# EAGLE schematic Maze_Project (EAGLE 8.7.0)
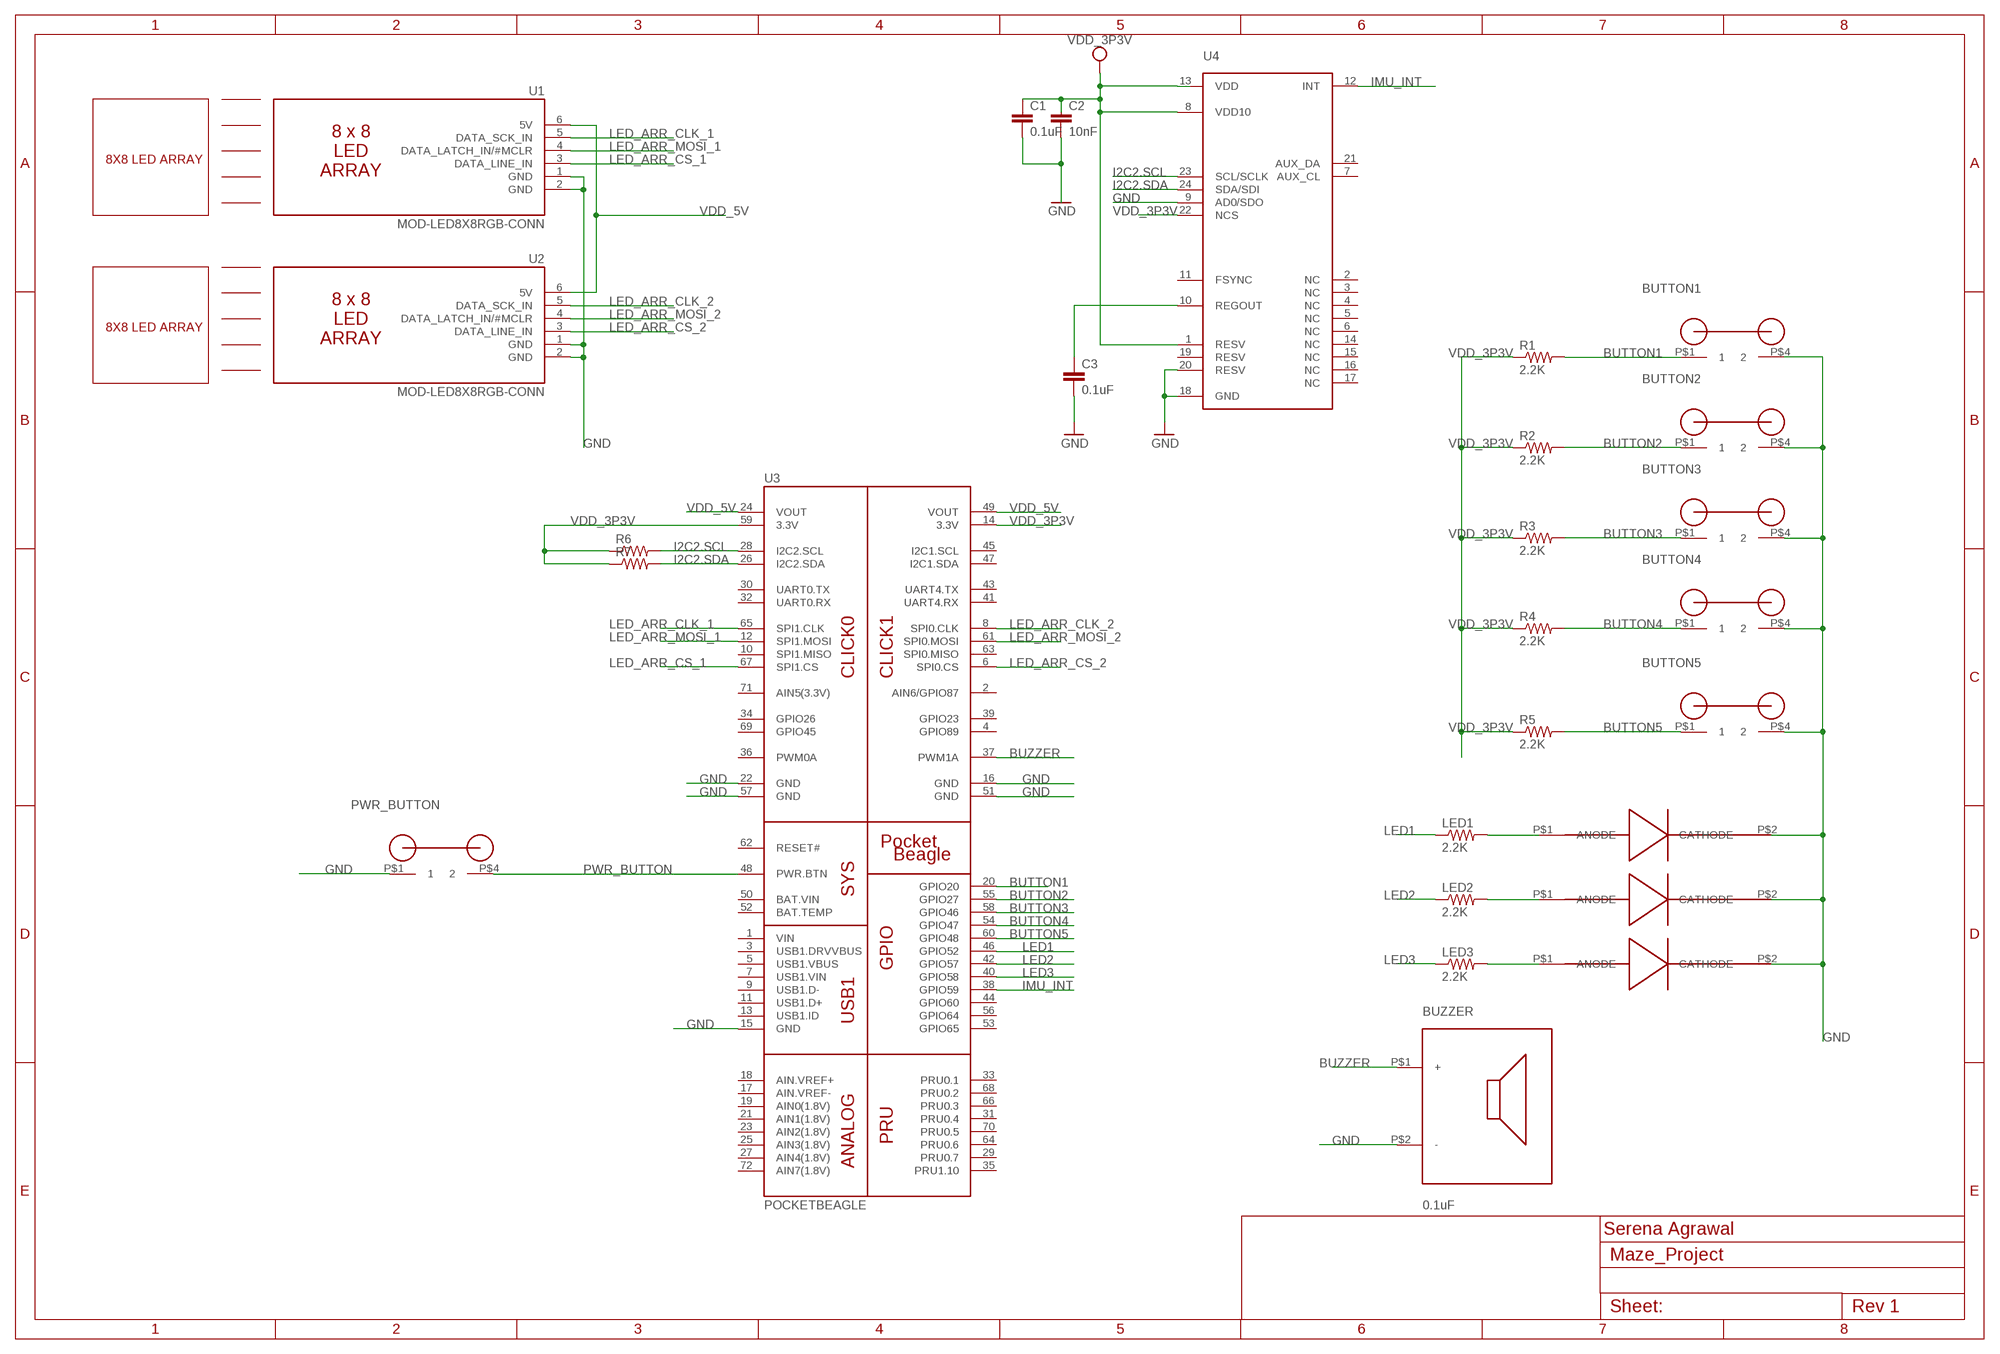
[diagram p0: schematic, sheet 1]

## Parts
BUTTON1  BUTTON  [BUTTON]
BUTTON2  BUTTON  [BUTTON]
BUTTON3  BUTTON  [BUTTON]
BUTTON4  BUTTON  [BUTTON]
BUTTON5  BUTTON  [BUTTON]
BUZZER  0.1uF  BUZZER  [BUZZER]
C1  0.1uF  C_C0402  [C0402]
C2  10nF  C_C0402  [C0402]
C3  0.1uF  C_C0402  [C0402]
LED1  2.2K  R_R0402  [R0402]
LED2  2.2K  R_R0402  [R0402]
LED3  2.2K  R_R0402  [R0402]
PWR_BUTTON  BUTTON  [BUTTON]
R1  2.2K  R_R0402  [R0402]
R2  2.2K  R_R0402  [R0402]
R3  2.2K  R_R0402  [R0402]
R4  2.2K  R_R0402  [R0402]
R5  2.2K  R_R0402  [R0402]
R6  R_R0402  [R0402]
R7  R_R0402  [R0402]
U1  MOD-LED8X8RGB-CONN  [FE06W]
U2  MOD-LED8X8RGB-CONN  [FE06W]
U3  POCKETBEAGLE  [POCKETBEAGLE]
U4  MPU-9250  [QFN-3MMX3MM]
U$7  LED  [LED]
U$8  LED  [LED]
U$9  LED  [LED]

## Nets
B: C3.2 U4.18(GND) U4.20(RESV) ; supply symbol labelled GND
BUTTON1: BUTTON1.P$1 R1.2 U3.20(GPIO20)
BUTTON2: BUTTON2.P$1 R2.2 U3.55(GPIO27)
BUTTON3: BUTTON3.P$1 R3.2 U3.58(GPIO46)
BUTTON4: BUTTON4.P$1 R4.2 U3.54(GPIO47)
BUTTON5: BUTTON5.P$1 R5.2 U3.60(GPIO48)
BUZZER: BUZZER.P$1(+) U3.37(PWM1A)
GND: BUTTON1.P$4 BUTTON2.P$4 BUTTON3.P$4 BUTTON4.P$4 BUTTON5.P$4 BUZZER.P$2(-) PWR_BUTTON.P$1 U1.1(GND) U1.2(GND) U2.1(GND) U2.2(GND) U3.15(GND) U3.16(GND) U3.22(GND) U3.51(GND) U3.57(GND) U4.9(AD0/SDO) U$7.P$2(CATHODE) U$8.P$2(CATHODE) U$9.P$2(CATHODE)
I2C2.SCL: R6.2 U3.28(I2C2.SCL) U4.23(SCL/SCLK)
I2C2.SDA: R7.2 U3.26(I2C2.SDA) U4.24(SDA/SDI)
IMU_INT: U3.38(GPIO59) U4.12(INT)
LED1: LED1.1 U3.46(GPIO52)
LED2: LED2.1 U3.42(GPIO57)
LED3: LED3.1 U3.40(GPIO58)
LED_ARR_CLK_1: U1.5(DATA_SCK_IN) U3.65(SPI1.CLK)
LED_ARR_CLK_2: U2.5(DATA_SCK_IN) U3.8(SPI0.CLK)
LED_ARR_CS_1: U1.3(DATA_LINE_IN) U3.67(SPI1.CS)
LED_ARR_CS_2: U2.3(DATA_LINE_IN) U3.6(SPI0.CS)
LED_ARR_MOSI_1: U1.4(DATA_LATCH_IN/#MCLR) U3.12(SPI1.MOSI)
LED_ARR_MOSI_2: U2.4(DATA_LATCH_IN/#MCLR) U3.61(SPI0.MOSI)
N$1: C1.2 C2.2 ; supply symbol labelled GND
N$2: C3.1 U4.10(REGOUT)
N$5: LED1.2 U$7.P$1(ANODE)
N$6: LED2.2 U$8.P$1(ANODE)
N$7: LED3.2 U$9.P$1(ANODE)
PWR_BUTTON: PWR_BUTTON.P$4 U3.48(PWR.BTN)
SYS_VDD1_3P3V: C1.1 C2.1 U4.1(RESV) U4.8(VDD10) U4.13(VDD) ; supply symbol labelled VDD_3P3V
VDD_3P3V: R1.1 R2.1 R3.1 R4.1 R5.1 R6.1 R7.1 U3.14(3.3V) U3.59(3.3V) U4.22(NCS)
VDD_5V: U1.6(5V) U2.6(5V) U3.24(VOUT) U3.49(VOUT)
Unconnected: U3.1(VIN) U3.2(AIN6/GPIO87) U3.3(USB1.DRVVBUS) U3.4(GPIO89) U3.5(USB1.VBUS) U3.7(USB1.VIN) U3.9(USB1.D-) U3.10(SPI1.MISO) U3.11(USB1.D+) U3.13(USB1.ID) U3.17(AIN.VREF-) U3.18(AIN.VREF+) U3.19(AIN0(1.8V)) U3.21(AIN1(1.8V)) U3.23(AIN2(1.8V)) U3.25(AIN3(1.8V)) U3.27(AIN4(1.8V)) U3.29(PRU0.7) U3.30(UART0.TX) U3.31(PRU0.4) U3.32(UART0.RX) U3.33(PRU0.1) U3.34(GPIO26) U3.35(PRU1.10) U3.36(PWM0A) U3.39(GPIO23) U3.41(UART4.RX) U3.43(UART4.TX) U3.44(GPIO60) U3.45(I2C1.SCL) U3.47(I2C1.SDA) U3.50(BAT.VIN) U3.52(BAT.TEMP) U3.53(GPIO65) U3.56(GPIO64) U3.62(RESET#) U3.63(SPI0.MISO) U3.64(PRU0.6) U3.66(PRU0.3) U3.68(PRU0.2) U3.69(GPIO45) U3.70(PRU0.5) U3.71(AIN5(3.3V)) U3.72(AIN7(1.8V)) U4.2(NC) U4.3(NC) U4.4(NC) U4.5(NC) U4.6(NC) U4.7(AUX_CL) U4.11(FSYNC) U4.14(NC) U4.15(NC) U4.16(NC) U4.17(NC) U4.19(RESV) U4.21(AUX_DA)

## Notes on the sheet
- 8X8 LED ARRAY
- 8X8 LED ARRAY
- Serena Agrawal

## Library data of the parts
BUTTON1-BUTTON5 PWR_BUTTON = ENGI_301_Maze:BUTTON
BUZZER = ENGI_301_Maze:BUZZER
C1-C3 = ENGI301_PCB_design_project:C_: Capacitor SMD. Sizes: 0402, 0603 & 0805
LED1-LED3 R1-R7 = ENGI301_design_example:R_: RESISTOR, American symbol
U1 U2 = ENGI301_Maze_Project_Parts (1):MOD-LED8X8RGB-CONN
U3 = ENGI301_Maze_Project_Parts:POCKETBEAGLE
U4 = ENGI301_PCB_design_project:MPU-9250
U$7-U$9 = ENGI_301_Maze:LED